# EAGLE design Canbus-Proto (EAGLE 6.4)
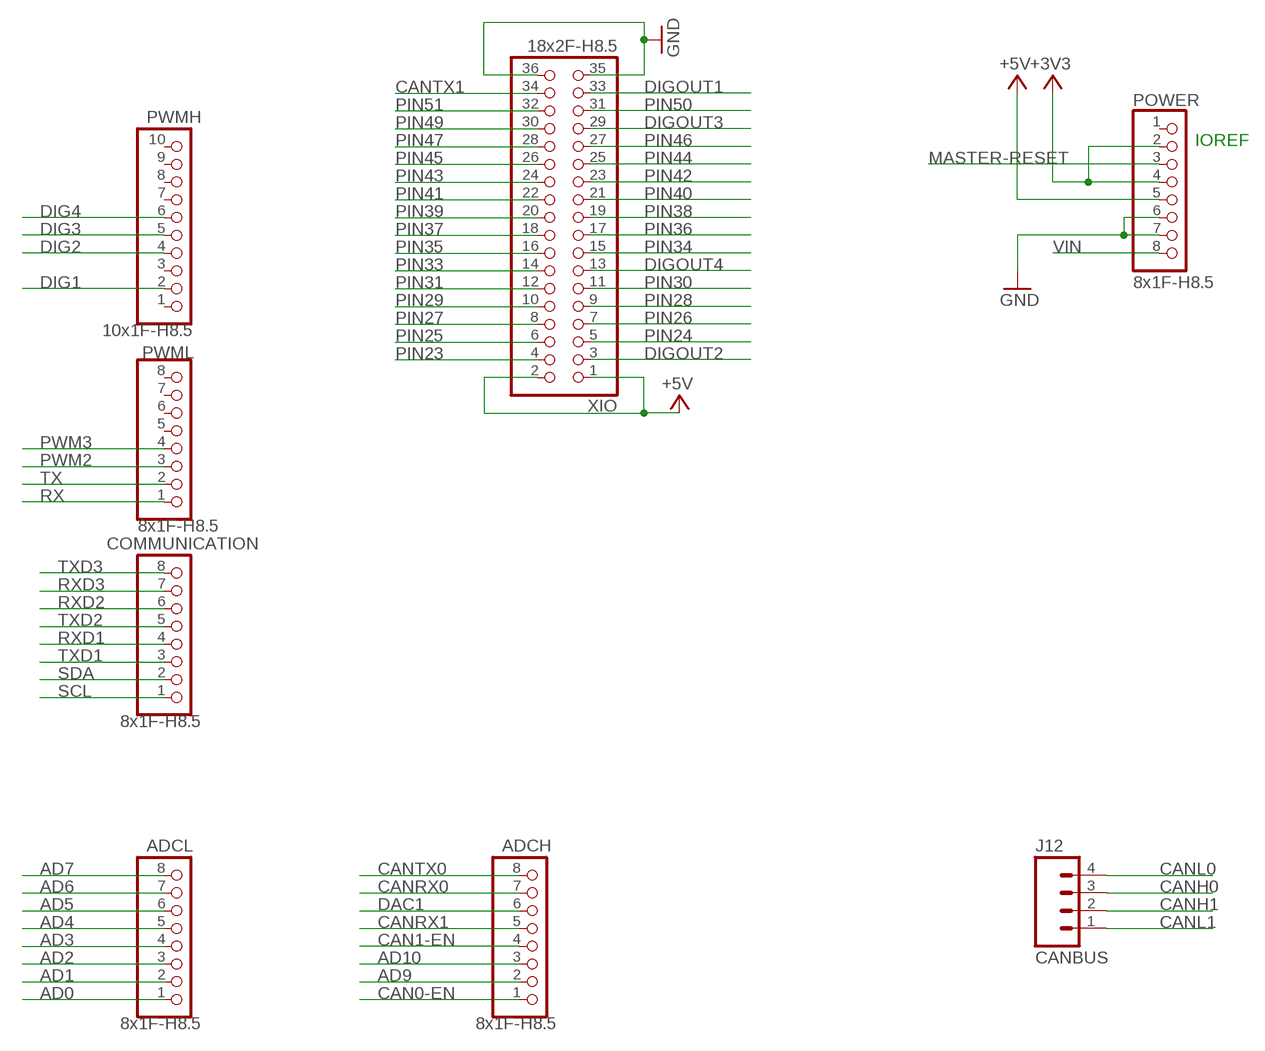
[diagram p0: schematic, sheet 1, part 1 of 2]
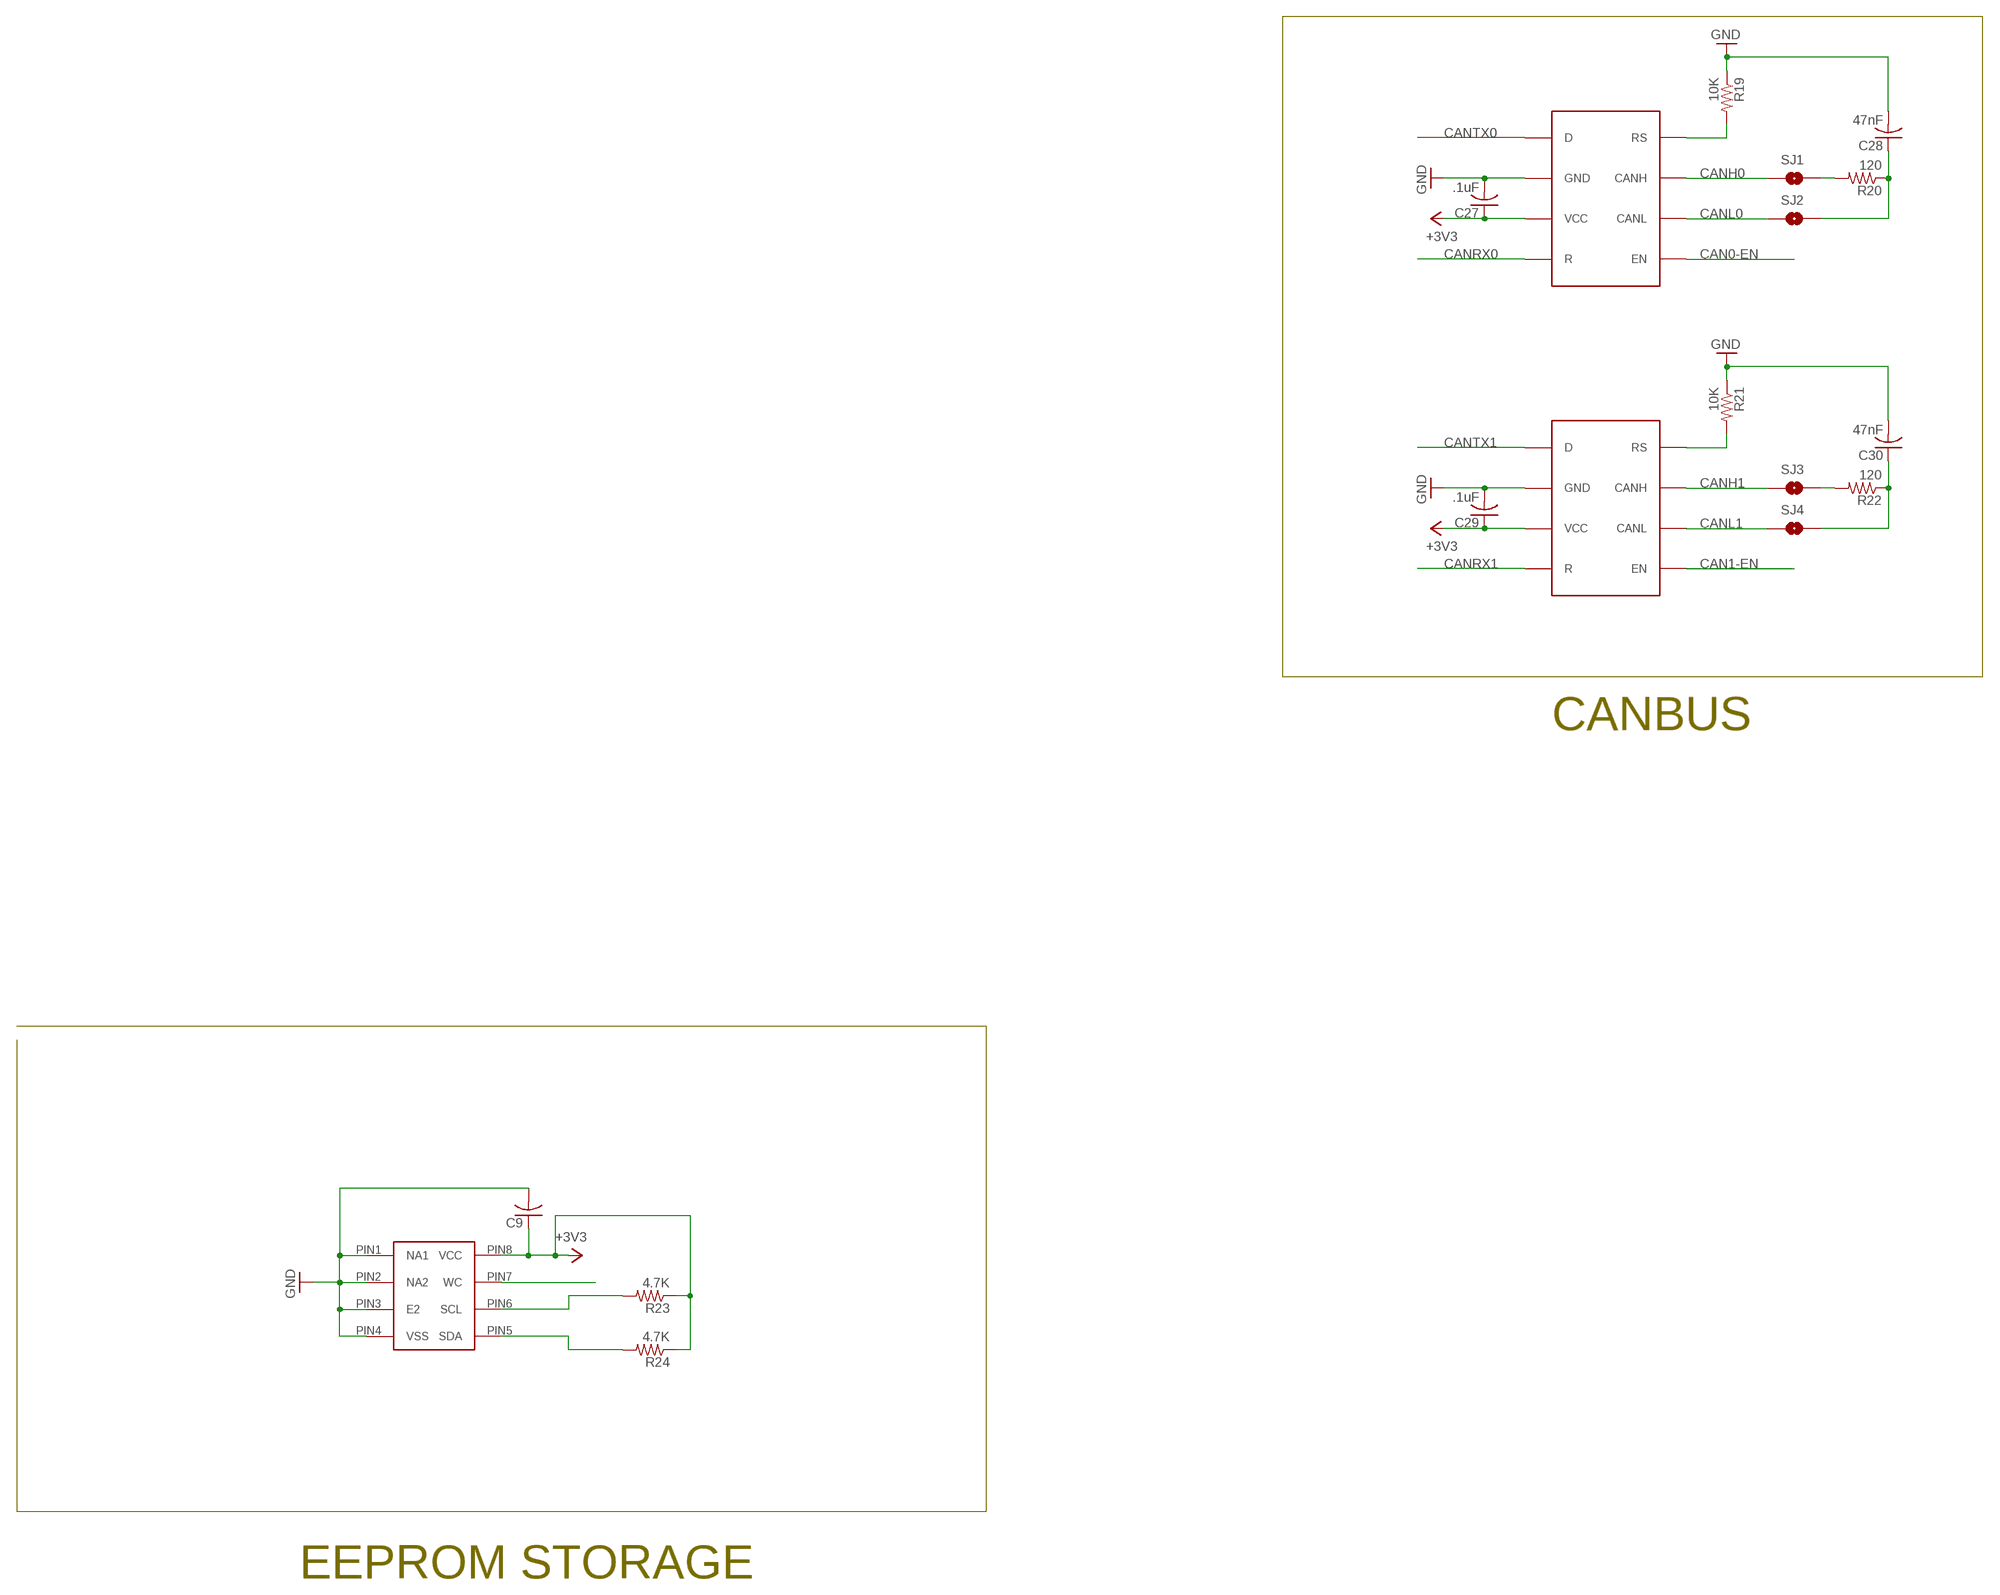
[diagram p1: schematic, sheet 1, part 2 of 2]

## Parts
ADCH  8x1F-H8.5  PINHD-1X8  [1X08]
ADCL  8x1F-H8.5  PINHD-1X8  [1X08]
C9  C-USC0603  [C0603]
C27  .1uF  C-USC0603  [C0603]
C28  47nF  C-USC0603  [C0603]
C29  .1uF  C-USC0603  [C0603]
C30  47nF  C-USC0603  [C0603]
COMMUNICATION  8x1F-H8.5  PINHD-1X8  [1X08]
J12  CANBUS  M04PTH  [1X04]
POWER  8x1F-H8.5  PINHD-1X8  [1X08]
PWMH  10x1F-H8.5  PINHD-1X10  [1X10]
PWML  8x1F-H8.5  PINHD-1X8  [1X08]
R19  10K  R-US_R0603  [R0603]
R20  120  R-US_R0603  [R0603]
R21  10K  R-US_R0603  [R0603]
R22  120  R-US_R0603  [R0603]
R23  4.7K  R-US_R0603  [R0603]
R24  4.7K  R-US_R0603  [R0603]
SJ1  SOLDERJUMPERNO  [SJ_2S-NO]
SJ2  SOLDERJUMPERNO  [SJ_2S-NO]
SJ3  SOLDERJUMPERNO  [SJ_2S-NO]
SJ4  SOLDERJUMPERNO  [SJ_2S-NO]
U$2  SN65HVD234  [SOIC8]
U$5  M24M02-DRMN6TP  [SOIC8]
U$6  SN65HVD234  [SOIC8]
XIO  18x2F-H8.5  PINHD-2X18  [2X18]

## Nets
+3V3: C9.1 C27.1 C29.1 POWER.2 POWER.4 R23.1 R24.1 U$2.PIN3(VCC) U$5.PIN8(VCC) U$6.PIN3(VCC)
+5V: POWER.5 XIO.1 XIO.2
AD0: ADCL.1
AD1: ADCL.2
AD2: ADCL.3
AD3: ADCL.4
AD4: ADCL.5
AD5: ADCL.6
AD6: ADCL.7
AD7: ADCL.8
AD9: ADCH.2
AD10: ADCH.3
CAN0-EN: ADCH.1 U$6.PIN5(EN)
CAN1-EN: ADCH.4 U$2.PIN5(EN)
CANH0: J12.3 SJ1.1 U$6.PIN7(CANH)
CANH1: J12.2 SJ3.1 U$2.PIN7(CANH)
CANL0: J12.4 SJ2.1 U$6.PIN6(CANL)
CANL1: J12.1 SJ4.1 U$2.PIN6(CANL)
CANRX0: ADCH.7 U$6.PIN4(R)
CANRX1: ADCH.5 U$2.PIN4(R)
CANTX0: ADCH.8 U$6.PIN1(D)
CANTX1: U$2.PIN1(D) XIO.34
DAC1: ADCH.6
DIG1: PWMH.2
DIG2: PWMH.4
DIG3: PWMH.5
DIG4: PWMH.6
DIGOUT1: XIO.33
DIGOUT2: XIO.3
DIGOUT3: XIO.29
DIGOUT4: XIO.13
GND: C9.2 C27.2 C28.2 C29.2 C30.2 POWER.6 POWER.7 R19.1 R21.1 U$2.PIN2(GND) U$5.PIN1(NA1) U$5.PIN2(NA2) U$5.PIN3(E2) U$5.PIN4(VSS) U$6.PIN2(GND) XIO.35 XIO.36
MASTER-RESET: POWER.3
N$24: R19.2 U$6.PIN8(RS)
N$26: C28.1 R20.1 SJ2.2
N$27: R20.2 SJ1.2
N$28: R21.2 U$2.PIN8(RS)
N$29: C30.1 R22.1 SJ4.2
N$30: R22.2 SJ3.2
PIN23: XIO.4
PIN24: XIO.5
PIN25: XIO.6
PIN26: XIO.7
PIN27: XIO.8
PIN28: XIO.9
PIN29: XIO.10
PIN30: XIO.11
PIN31: XIO.12
PIN33: XIO.14
PIN34: XIO.15
PIN35: XIO.16
PIN36: XIO.17
PIN37: XIO.18
PIN38: XIO.19
PIN39: XIO.20
PIN40: XIO.21
PIN41: XIO.22
PIN42: XIO.23
PIN43: XIO.24
PIN44: XIO.25
PIN45: XIO.26
PIN46: XIO.27
PIN47: XIO.28
PIN49: XIO.30
PIN50: XIO.31
PIN51: XIO.32
PWM2: PWML.3
PWM3: PWML.4
RX: PWML.1
RXD1: COMMUNICATION.4 U$5.PIN7(WC)
RXD2: COMMUNICATION.6
RXD3: COMMUNICATION.7
SCL: COMMUNICATION.1 R23.2 U$5.PIN6(SCL)
SDA: COMMUNICATION.2 R24.2 U$5.PIN5(SDA)
TX: PWML.2
TXD1: COMMUNICATION.3
TXD2: COMMUNICATION.5
TXD3: COMMUNICATION.8
VIN: POWER.8
Unconnected: POWER.1 PWMH.1 PWMH.3 PWMH.7 PWMH.8 PWMH.9 PWMH.10 PWML.5 PWML.6 PWML.7 PWML.8

## Notes on the sheet
- IOREF
- CANBUS
- EEPROM STORAGE

## Library data of the parts
ADCH ADCL COMMUNICATION POWER PWML = SmartPrj:PINHD-1X8: PIN HEADER
C9 C27-C30 = rcl:C-US: CAPACITOR, American symbol
J12 = SparkFun-Connectors:M04: Header 4 Standard 4-pin 0.1" header. Use with straight break away headers (SKU : PRT-00116), right angle break away headers (PRT-00553), swiss pins (PRT-00743), machine pins (PRT-00117), and female headers (PRT-00115). Molex polarized connector foot print use with SKU : PRT-08231 with associated crimp pins and housings. 1MM SMD Version SKU: PRT-10208
PWMH = SmartPrj:PINHD-1X10: PIN HEADER
R19-R24 = rcl:R-US_: RESISTOR, American symbol
SJ1-SJ4 = SparkFun-Passives:SOLDERJUMPER: Solder Jumper Standard SMD solder jumper. Used to automate production. Two varients : Normally Open and Normally Closed are the same, but have different paste layers. NC will have a large amount of paste and should jumper during reflow.
U$2 U$6 = ck_custom:SN65HVD234
U$5 = ck_custom:M24M02-DRMN6TP
XIO = SmartPrj:PINHD-2X18: PIN HEADER

## Net classes
0 default: width 0.203 mm, drill 0.305 mm, clearance 0.203 mm
1 USB: drill 0.406 mm, clearance 0.203 mm to class 0, clearance 0.406 mm
2 gnd: width 0.305 mm, drill 0.406 mm, clearance 0.203 mm to class 0, clearance 0.203 mm
3 usbvcc: width 0.61 mm, drill 0.508 mm, clearance 0.203 mm to class 0, clearance 0.254 mm

## Board
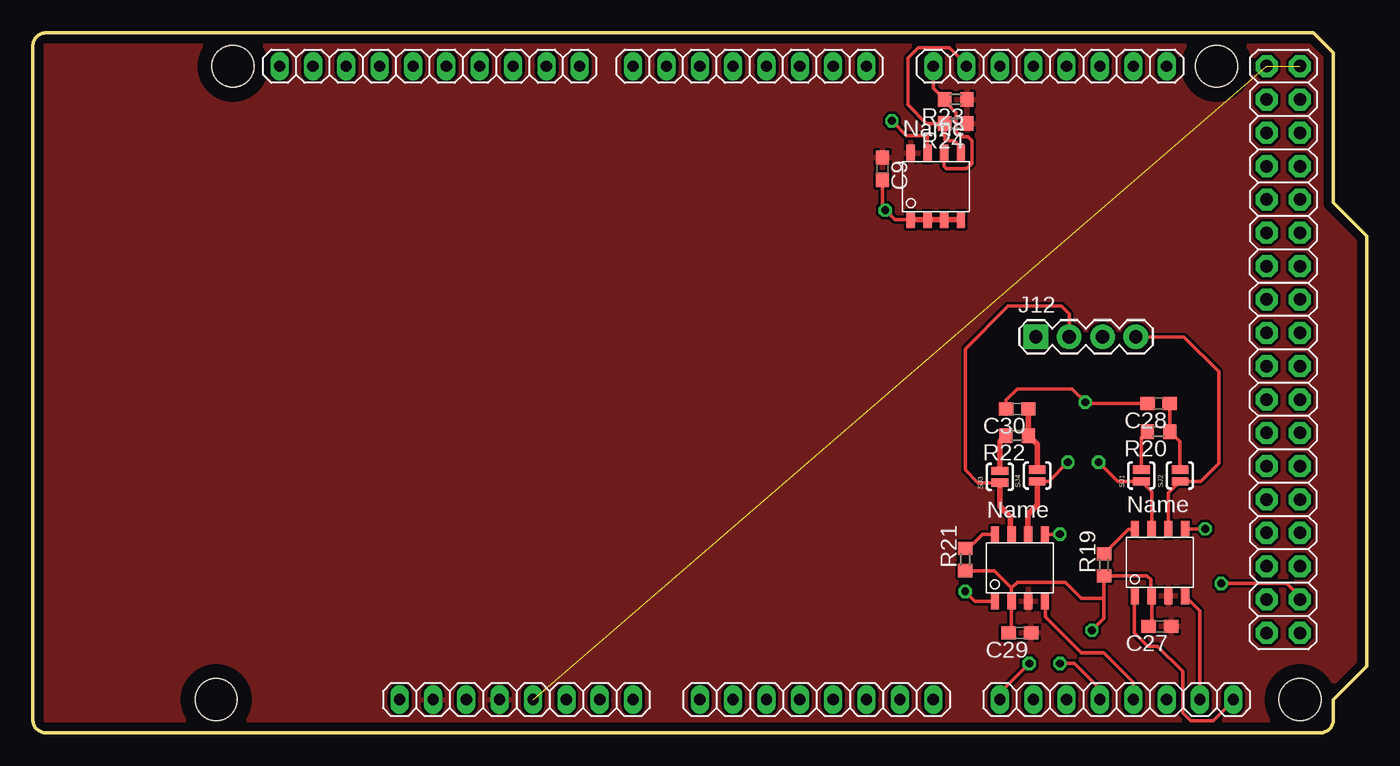
[diagram p2: board, top side]
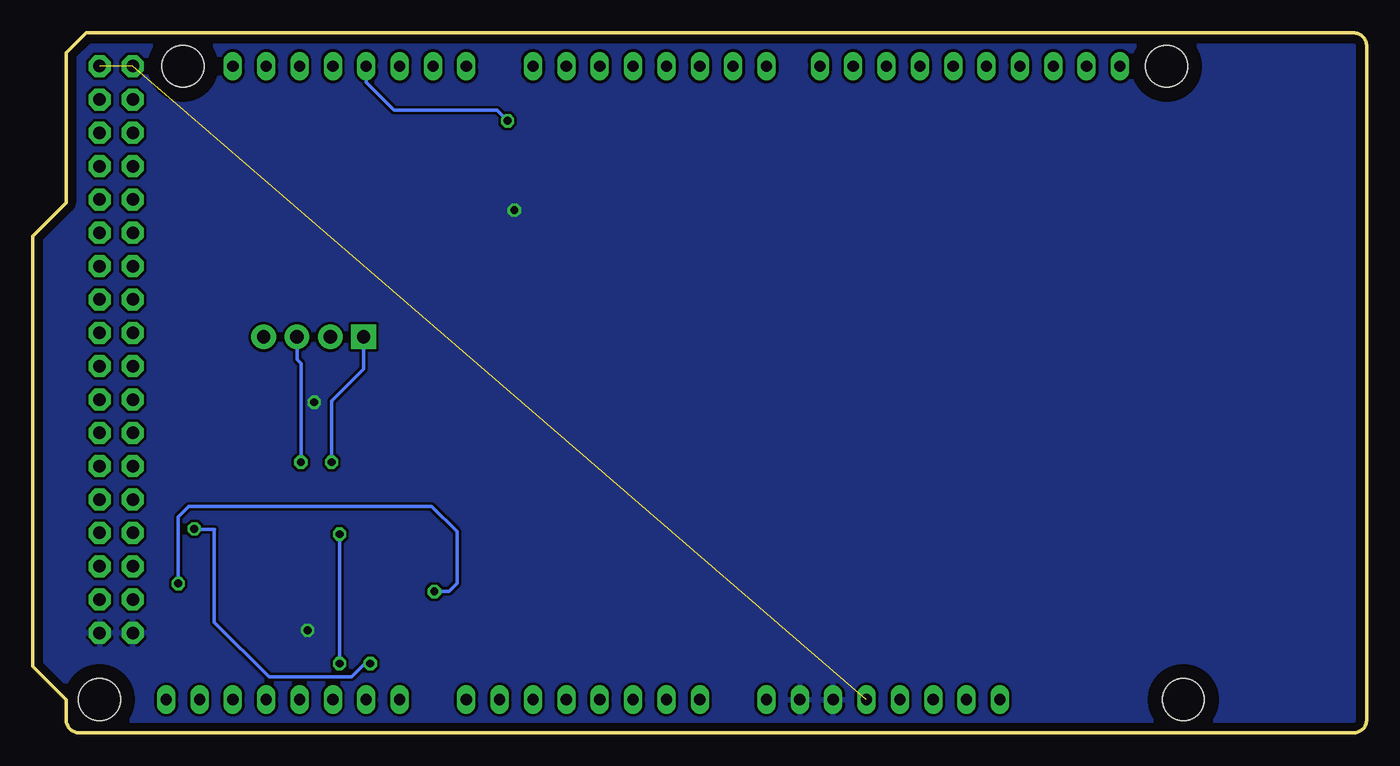
[diagram p3: board, bottom side, seen from below]

Size 101.6 x 53.34 mm. Coordinates in mm from the lower left corner, seen from the top.
Outline: 97.54,53.34 99.06,51.82 99.06,40.39 101.6,37.85 101.6,5.08 99.06,2.54 99.06,1 arc-90 98.06,0 1,0 arc-90 0,1 0,52.34 arc-90 1,53.34 97.54,53.34
Copper layers (1*16): Top 0.035mm / dielectric 0.2mm / Bottom 0.035mm
Design rules "default *": minimum track width 8mil, minimum drill 16mil, track to track 8mil, track to pad 8mil, pad to pad 6mil, via to via 8mil, smd to smd 6mil, copper to edge 25mil, drill to drill 12mil, minimum pad ring 8mil, minimum via ring 8mil, stop-mask expansion 2mil, vias tented up to drill 25mil, thermal gap 8mil
Holes 3.2 mm at 96.52,2.54 15.24,50.8 90.17,50.8 13.97,2.54
tRestrict: area 12.7,48.3 to 17.8,53.3; area 87.6,48.3 to 92.7,53.3; area 94,0 to 99.1,5.1; area 11.4,0 to 16.5,5.1
bRestrict: area 12.7,48.3 to 17.8,53.3; area 87.6,48.3 to 92.7,53.3; area 94,0 to 99.1,5.1; area 11.4,0 to 16.5,5.1

### Footprints (pad centres in the part's own frame; a part is rotated, then mirrored left to right if it is on the bottom)
1X08 = drill 0.85 pad 1.422 long: 1 -8.89,0; 2 -6.35,0; 3 -3.81,0; 4 -1.27,0; 5 1.27,0; 6 3.81,0; 7 6.35,0; 8 8.89,0
C0603 = smd 1.1 x 1: 1 -0.85,0; 2 0.85,0
1X04 = drill 1.016 pad 1.88 square: 1 0,0 | drill 1.016 pad 1.88: 2 2.54,0; 3 5.08,0; 4 7.62,0
1X10 = drill 0.85 pad 1.422 long: 1 -11.43,0; 2 -8.89,0; 3 -6.35,0; 4 -3.81,0; 5 -1.27,0; 6 1.27,0; 7 3.81,0; 8 6.35,0; 9 8.89,0; 10 11.43,0
R0603 = smd 1 x 1.1: 1 -0.85,0; 2 0.85,0
SJ_2S-NO = smd 0.635 x 1.27: 1 -0.45,0; 2 0.45,0
SOIC8 = smd 0.635 x 1.27: PIN1 0.635,-0.635; PIN2 1.905,-0.635; PIN3 3.175,-0.635; PIN4 4.445,-0.635; PIN5 4.445,4.445; PIN6 3.175,4.445; PIN7 1.905,4.445; PIN8 0.635,4.445
2X18 = drill 0.95 pad 1.676 octagon: 1 -21.59,-1.27; 2 -21.59,1.27; 3 -19.05,-1.27; 4 -19.05,1.27; 5 -16.51,-1.27; 6 -16.51,1.27; 7 -13.97,-1.27; 8 -13.97,1.27; 9 -11.43,-1.27; 10 -11.43,1.27; 11 -8.89,-1.27; 12 -8.89,1.27; 13 -6.35,-1.27; 14 -6.35,1.27; 15 -3.81,-1.27; 16 -3.81,1.27; 17 -1.27,-1.27; 18 -1.27,1.27; 19 1.27,-1.27; 20 1.27,1.27; 21 3.81,-1.27; 22 3.81,1.27; 23 6.35,-1.27; 24 6.35,1.27; 25 8.89,-1.27; 26 8.89,1.27; 27 11.43,-1.27; 28 11.43,1.27; 29 13.97,-1.27; 30 13.97,1.27; 31 16.51,-1.27; 32 16.51,1.27; 33 19.05,-1.27; 34 19.05,1.27; 35 21.59,-1.27; 36 21.59,1.27

### Placement (x,y rotation side)
ADCH  82.55,2.54 0 top
ADCL  59.69,2.54 0 top
C9  64.72,42.98 270 top
C27  85.85,8.13 180 top
C28  85.75,25.1 180 top
C29  75.18,7.62 180 top
C30  74.98,24.69 180 top
COMMUNICATION  77.47,50.8 0 top
J12  76.4,30.18 0 top
POWER  36.83,2.54 0 top
PWMH  30.23,50.8 180 top
PWML  54.61,50.8 180 top
R19  81.58,12.8 90 top
R20  85.75,22.96 180 top
R21  71.02,13.21 90 top
R22  74.98,22.66 180 top
R23  70.31,48.26 180 top
R24  70.31,46.43 180 top
SJ1  84.43,19.61 90 top
SJ2  87.38,19.61 90 top
SJ3  73.66,19.51 90 top
SJ4  76.5,19.61 90 top
U$2  72.64,10.67 0 top
U$5  66.24,39.73 0 top
U$6  83.31,11.07 0 top
XIO  95.25,29.21 270 top

### Tracks (layer width: path | path; a pad name or v marks a point on that pad's centre or on a via)
+3V3
  pour Top: 1.02,52.43 100.99,52.43 100.99,0.61 1.02,0.61
+5V  (2 unrouted)
CAN0-EN  (via drill 0.6)
  Top 0.254: ADCH.1 73.66,3.05 v75.89,5.28 | v89.31,15.54 87.78,15.54 U$6.PIN5
  Bottom 0.254: v75.89,5.28 76.3,5.28 77.32,4.27 83.62,4.27 87.78,8.43 87.78,15.49 U$6.PIN5 89.28,15.52 v89.31,15.54
CAN1-EN  (via drill 0.6)
  Top 0.254: ADCH.4 81.28,3.35 79.35,5.28 v78.23,5.28 | v78.23,15.14 77.11,15.14 U$2.PIN5
  Bottom 0.254: v78.23,5.28 v78.23,15.14
CANH0  (via drill 0.6)
  Top 0.254: U$6.PIN7 85.22,18.37 SJ1.1 82.64,19.16 v81.18,20.62
  Bottom 0.254: v81.18,20.62 81.18,28.14 81.48,28.45 J12.3
CANH1
  Top 0.254: SJ3.1 71.98,19.06 71.02,20.02 71.02,29.26 74.27,32.51 78.33,32.51 78.94,31.9 J12.2
  Top 0.406: SJ3.1 73.66,17.27 74.47,16.46 74.47,15.19 U$2.PIN7
CANL0
  Top 0.254: U$6.PIN6 86.49,18.27 SJ2.1 88.96,19.16 90.32,20.52 90.32,27.53 87.68,30.18 J12.4
CANL1  (via drill 0.6)
  Top 0.254: SJ4.1 77.38,19.16 v78.84,20.62
  Top 0.406: SJ4.1 76.5,17.37 75.79,16.66 75.79,15.14 U$2.PIN6
  Bottom 0.254: v78.84,20.62 78.84,25.3 76.4,27.74 J12.1
CANRX0
  Top 0.254: ADCH.7 88.9,9.3 U$6.PIN4
CANRX1
  Top 0.254: ADCH.5 83.82,3.86 81.58,6.1 79.86,6.1 77.11,8.84 77.11,10.01
  Top 0.406: 77.11,10.01 U$2.PIN4
CANTX0
  Top 0.254: ADCH.8 91.44,2.44 89.92,0.91 88.19,0.91 87.58,1.52 87.58,4.67 85.65,6.6 84.94,6.6 83.92,7.62 83.92,10.41 U$6.PIN1
CANTX1  (via drill 0.6)
  Top 0.254: XIO.34 96.52,10.36 95.5,11.38 v90.53,11.38 | U$2.PIN1 71.75,10.03 v71.02,10.77
  Bottom 0.254: v90.53,11.38 90.53,16.46 89.71,17.27 71.22,17.27 69.29,15.34 69.29,11.38 69.9,10.77 v71.02,10.77
GND  (via drill 0.6)
  Top 0.254: C9.2 64.72,40.03 v64.92,39.83 65.66,39.09 U$5.PIN1 | C30.2 74.13,25.36 74.98,26.21 79.15,26.21 v80.16,25.2 80.26,25.09 C28.2 | 81.58,10.16 R19.1 84.87,11.95 85.14,11.68 85.14,10.52 | 81.58,10.16 81.58,8.74 v80.67,7.82 | U$6.PIN2 85.22,8.34 | 74.55,7.83 U$2.PIN2 74.55,11.05 | 74.55,11.05 74.98,11.48 78.64,11.48 79.86,10.26 81.48,10.26 81.58,10.16 | R21.1 73.24,12.36 74.55,11.05
  Top 0.406: U$5.PIN1 U$5.PIN2 U$5.PIN3 U$5.PIN4 | 85.14,10.52 U$6.PIN2 | 85.22,8.34 C27.2 | 74.55,7.83 C29.2
  pour Bottom: 1.02,52.32 100.99,52.32 100.99,0.61 1.02,0.61
N$24
  Top 0.254: U$6.PIN8 83.45,15.52 R19.2
N$26
  Top 0.254: C28.1 R20.1 87.38,22.19 SJ2.2
N$27
  Top 0.254: R20.2 84.43,22.49 SJ1.2
N$28
  Top 0.254: 71.26,14.06 72.34,15.14 73.25,15.14
  Top 0.406: R21.2 71.26,14.06 | 73.25,15.14 U$2.PIN8
N$29
  Top 0.406: C30.1 R22.1 76.5,21.98 SJ4.2
N$30
  Top 0.406: R22.2 73.66,22.19 SJ3.2
RXD1  (via drill 0.6)
  Top 0.254: v65.43,46.63 66.55,45.52 68.07,45.52 68.15,45.44 U$5.PIN7
  Bottom 0.254: COMMUNICATION.4 76.2,49.58 74.07,47.45 66.24,47.45 v65.43,46.63
SCL
  Top 0.254: COMMUNICATION.1 68.58,49.14 R23.2 69.46,48.09 70.31,47.24 70.31,45.82 70.71,45.41 71.22,45.41 71.53,45.11 71.53,43.38 71.12,42.98 69.6,42.98 69.39,43.18 69.39,44.15 U$5.PIN6
SDA
  Top 0.254: COMMUNICATION.2 71.12,50.9 69.8,52.22 67.46,52.22 66.65,51.41 66.65,47.85 68.07,46.43 R24.2 69.46,45.15 69.49,45.11 70.21,45.11 70.51,44.81 70.51,44.35 U$5.PIN5